# EAGLE design Analog PDB V1 (EAGLE 9.5.1)
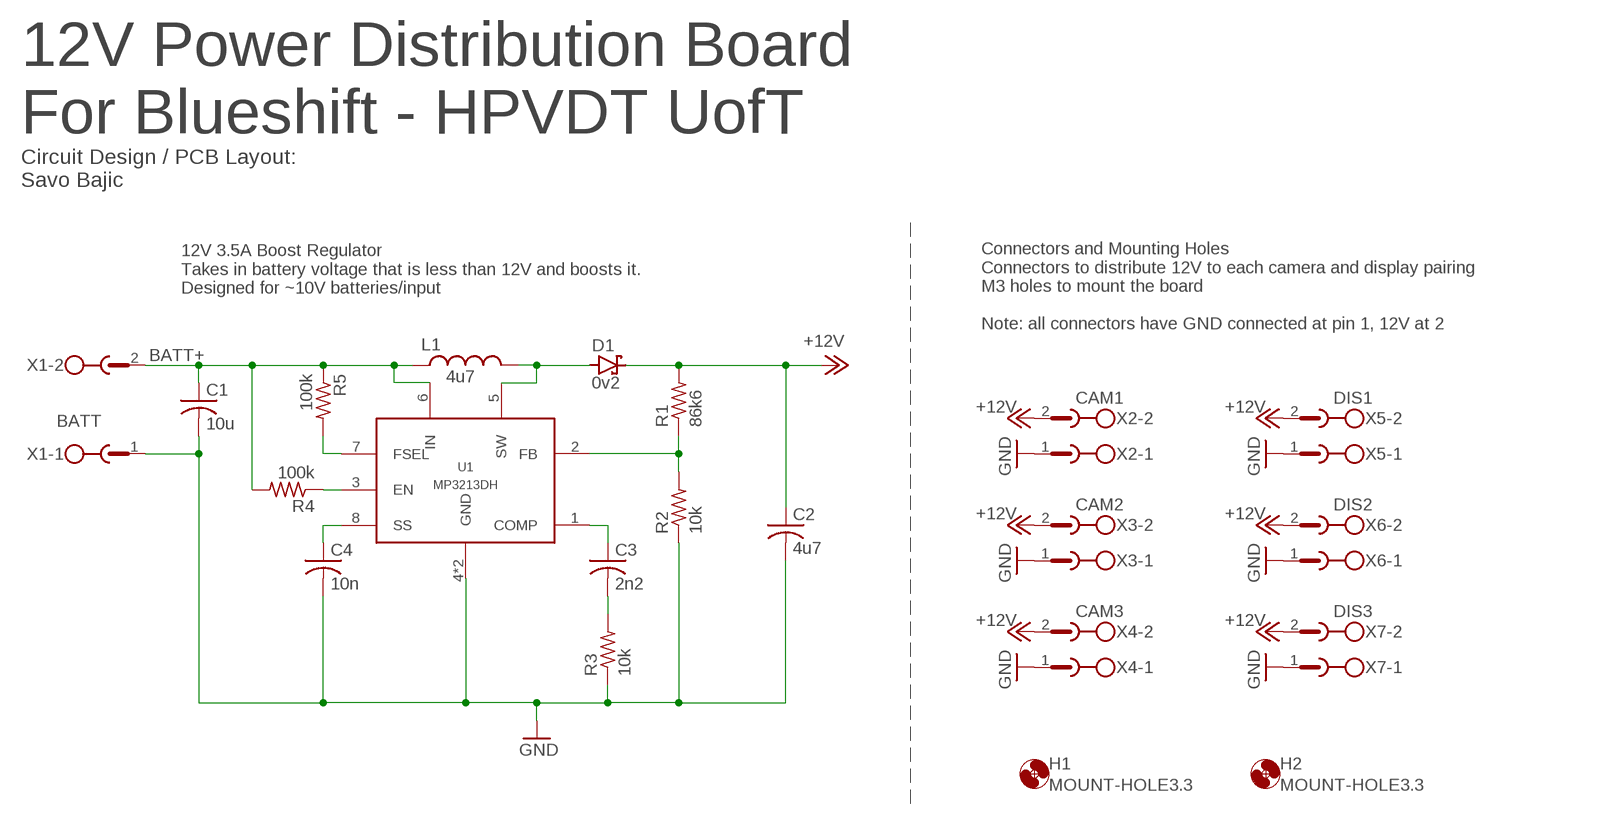
[diagram p0: schematic, sheet 1]

## Parts
C1  10u  C-USC0603  [C0603]
C2  4u7  C-USC0603  [C0603]
C3  2n2  C-USC0603  [C0603]
C4  10n  C-USC0603  [C0603]
D1  0v2  BOOSTDIODE  [DO-214AB]
H1  MOUNT-HOLE3.3  [3,3]
H2  MOUNT-HOLE3.3  [3,3]
L1  4u7  SDEI054T  [SDES053T]
R1  86k6  R-US_R0402  [R0402]
R2  10k  R-US_R0402  [R0402]
R3  10k  R-US_R0402  [R0402]
R4  100k  R-US_R0402  [R0402]
R5  100k  R-US_R0402  [R0402]
U1  MP3213DH  [8-TSSOP]
X1  BATT  MST2V  [MSTBV2]
X2  CAM1  MSTBV2  [MSTBV2]
X3  CAM2  MSTBV2  [MSTBV2]
X4  CAM3  MSTBV2  [MSTBV2]
X5  DIS1  MSTBV2  [MSTBV2]
X6  DIS2  MSTBV2  [MSTBV2]
X7  DIS3  MSTBV2  [MSTBV2]

## Nets
+12V: C2.1 D1.C R1.2 X2.2 X3.2 X4.2 X5.2 X6.2 X7.2
BATT+: C1.1 L1.1 R4.2 R5.1 U1.6(IN) X1.2
EN: R4.1 U1.3(EN)
FEEDBACK: R1.1 R2.2 U1.2(FB)
FREQSELECT: R5.2 U1.7(FSEL)
GND: C1.2 C2.2 C4.2 R2.1 R3.1 U1.4(GND) U1.P(GND) X1.1 X2.1 X3.1 X4.1 X5.1 X6.1 X7.1
N$1: D1.A L1.2 U1.5(SW)
N$5: C3.1 U1.1(COMP)
N$6: C3.2 R3.2
SOFTSTART: C4.1 U1.8(SS)

## Notes on the sheet
- 12V Power Distribution Board
  For Blueshift - HPVDT UofT
- Circuit Design / PCB Layout:
  Savo Bajic
- 12V 3.5A Boost Regulator
  Takes in battery voltage that is less than 12V and boosts it.
  Designed for ~10V batteries/input
- Connectors and Mounting Holes
  Connectors to distribute 12V to each camera and display pairing
  M3 holes to mount the board
  
  Note: all connectors have GND connected at pin 1, 12V at 2

## Library data of the parts
C1-C4 = rcl:C-US: CAPACITOR, American symbol; SPICEPREFIX: C
D1 = ASME2020_parts:BOOSTDIODE
H1 H2 = holes:MOUNT-HOLE: MOUNTING HOLE with drill center marker
L1 = ASME2020_parts:SDEI054T: 4.7uH Inductor
R1-R5 = rcl:R-US_: RESISTOR, American symbol; SPICEPREFIX: R
U1 = ASME2020_parts:MP3213DH: 3.5A Boost Converter Regulator
X1 = con-phoenix-508:MST2V: PHOENIX; OC_FARNELL: unknown; OC_NEWARK: unknown
X2-X7 = con-phoenix-508:MSTBV2: PHOENIX; MPN: MSTBV 2,5/2-GF-5.08; OC_FARNELL: 1792792; OC_NEWARK: 69R9845

## Board
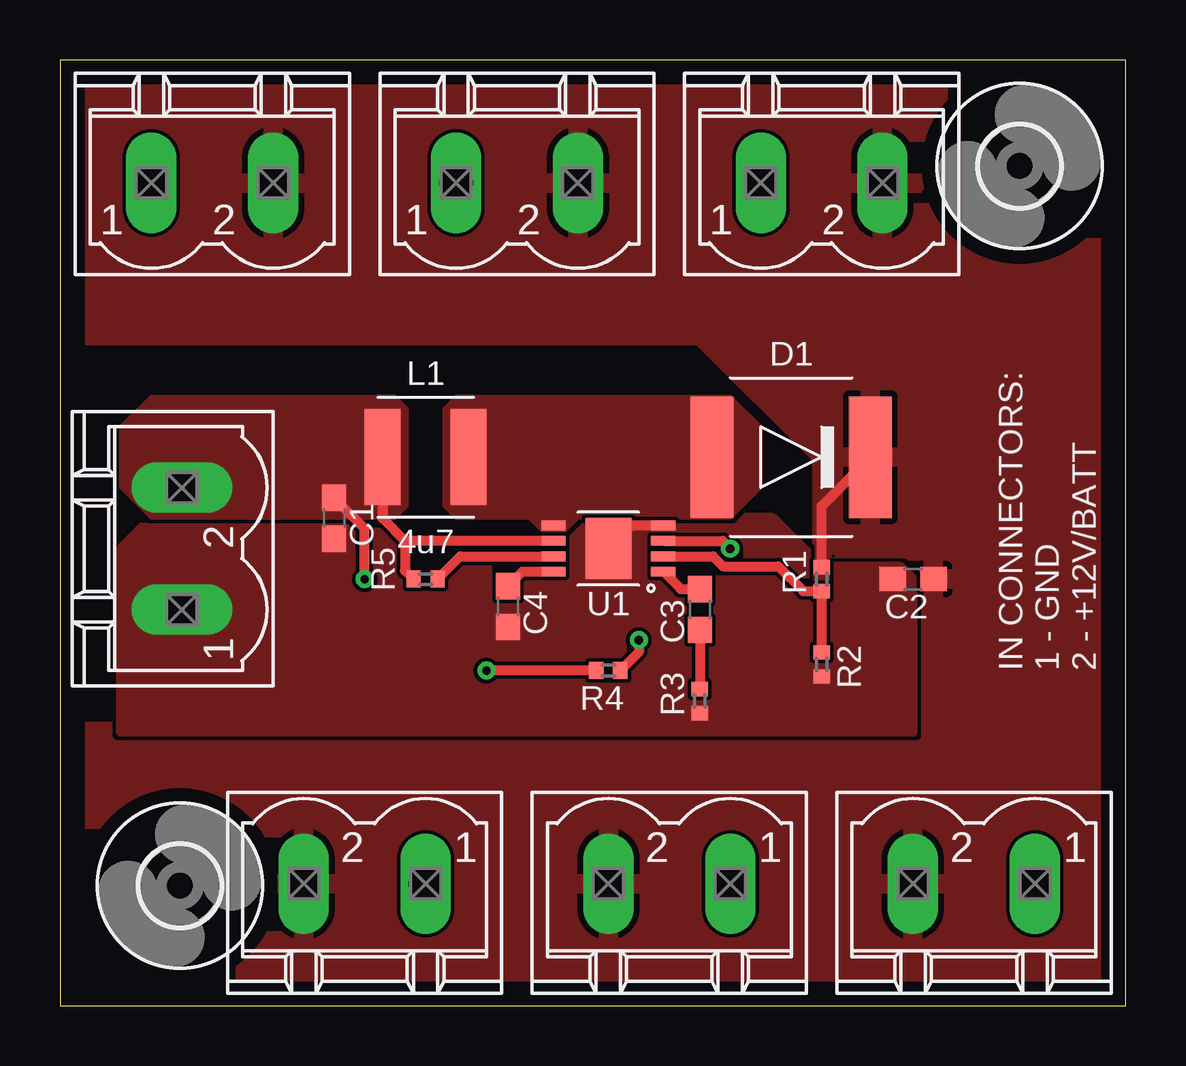
[diagram p1: board, top side]
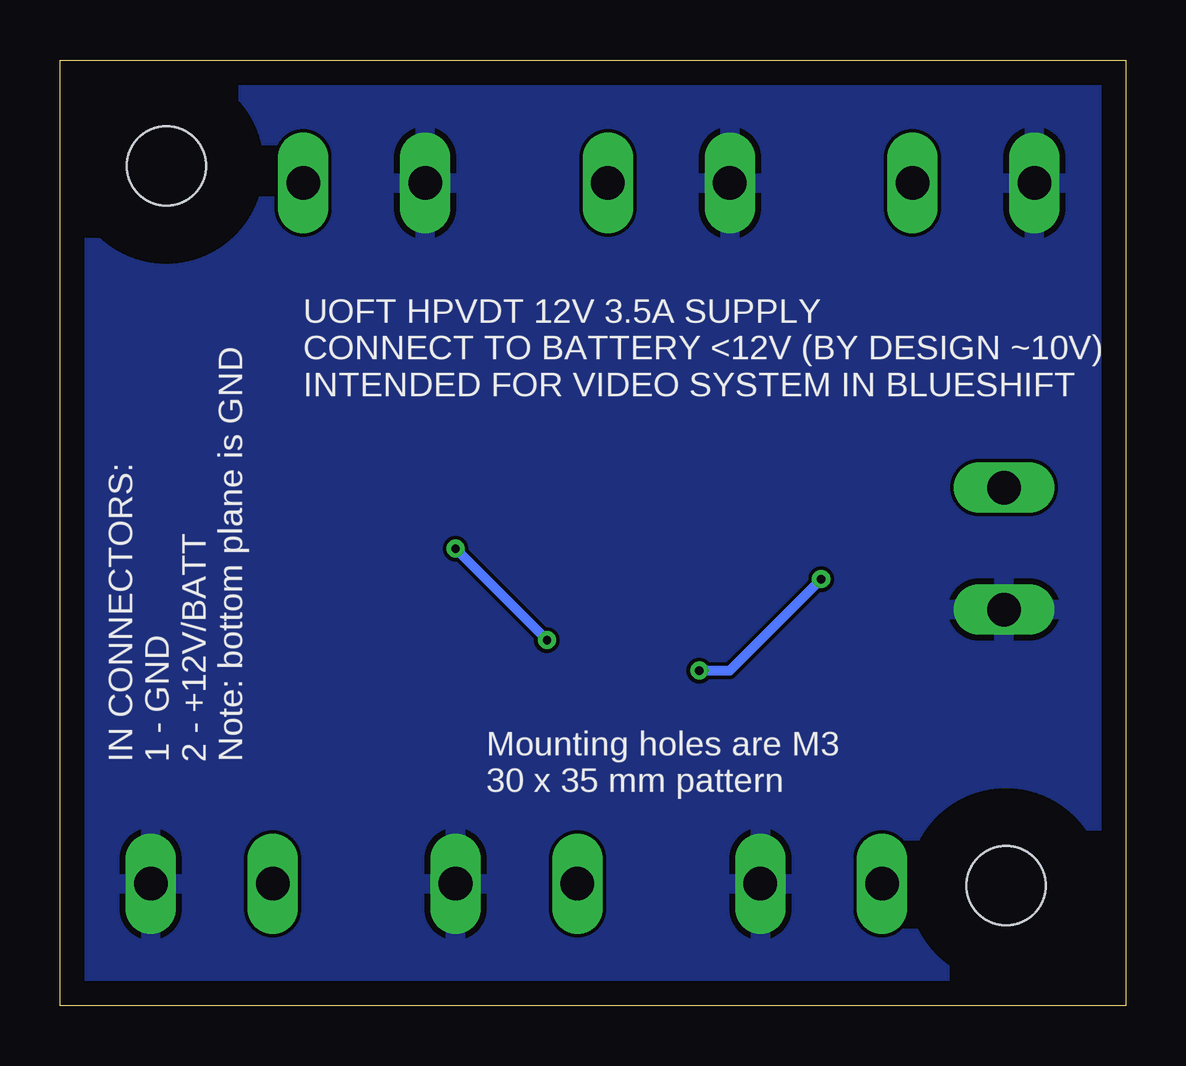
[diagram p2: board, bottom side, seen from below]

Size 44.43 x 39.42 mm. Coordinates in mm from the lower left corner, seen from the top.
Outline: 0,0 44.43,0 44.43,39.42 0,39.42 0,0
Copper layers (1*16): Top 0.035mm / dielectric 1.5mm / Bottom 0.035mm
Design rules "default": minimum track width 6mil, minimum drill 0.35mm, track to track 6mil, track to pad 6mil, pad to pad 6mil, via to via 6mil, smd to smd 6mil, copper to edge 40mil, drill to drill 6mil, minimum pad ring 10mil, minimum via ring 8mil, stop-mask expansion 4mil, vias tented up to drill 0mil, thermal gap 10mil

### Footprints (pad centres in the part's own frame; a part is rotated, then mirrored left to right if it is on the bottom)
C0603 = smd 1.1 x 1: 1 -0.85,0; 2 0.85,0
DO-214AB = smd 1.778 x 5.08: A -3.302,0; C 3.302,0
3,3 = hole 3.3: 0,0
SDES053T = smd 1.5 x 4: 1 -1.8,0; 2 1.8,0
R0402 = smd 0.6 x 0.7: 1 -0.5,0; 2 0.5,0
8-TSSOP = smd 1.016 x 0.406: 1 -2.286,0.96; 2 -2.286,0.325; 3 -2.286,-0.325; 4 -2.286,-0.96; 5 2.286,-0.96; 6 2.286,-0.325; 7 2.286,0.325; 8 2.286,0.96 | smd 1.905 x 2.54: P 0,0
MSTBV2 = drill 1.397 long: 1 -2.54,0; 2 2.54,0

### Placement (x,y rotation side)
C1  11.43,20.32 270 top
C2  35.56,17.78 180 top
C3  26.67,16.51 270 top
C4  18.67,16.64 270 top
D1  30.48,22.86 0 top
H1  5,5 0 top
H2  40,35 0 top
L1  15.24,22.86 0 top
R1  31.75,17.78 90 top
R2  31.75,14.22 90 top
R3  26.67,12.7 90 top
R4  22.86,13.97 180 top
R5  15.24,17.78 0 top
U1  22.86,19.05 180 top
X1  5.08,19.05 90 top
X2  25.4,5.08 180 top
X3  31.75,34.29 0 top
X4  6.35,34.29 0 top
X5  12.7,5.08 180 top
X6  38.1,5.08 180 top
X7  19.05,34.29 0 top

### Tracks (layer width: path | path; a pad name or v marks a point on that pad's centre or on a via)
+12V
  Top 0.406: R1.2 31.75,20.83 D1.C
  pour Top (rank 3): 0,0 0,11.43 35.56,11.43 35.56,17.78 31.75,17.78 31.75,22.86 26.67,27.94 0,27.94 0,39.37 44.45,39.37 44.45,0
BATT+  (via drill 0.35)
  Top 0.406: L1.1 13.44,20.32 14.38,19.38 | U1.6 14.38,19.38 | 14.38,19.38 14.38,18.14 R5.1 | R4.2 v17.78,13.97 | v12.7,17.78 12.7,19.9 C1.1
  Bottom 0.406: v17.78,13.97 16.51,13.97 v12.7,17.78
  pour Top (no thermals): 13.97,20.32 3.81,20.32 2.54,21.59 2.54,24.13 3.81,25.4 13.97,25.4 14.48,24.89 14.48,20.83
EN  (via drill 0.35)
  Top 0.406: v24.13,15.24 24.13,14.74 R4.1 | U1.3 27.61,19.38 v27.94,19.05
  Bottom 0.406: v24.13,15.24 v27.94,19.05
FEEDBACK
  Top 0.406: U1.2 27.23,18.73 27.64,18.32 29.94,18.32 30.98,17.28 R1.1 R2.2
FREQSELECT
  Top 0.406: R5.2 16.68,18.73 U1.7
GND
  Top 0.406: U1.4 23.82,20.01 U1.P
  pour Bottom: 0,0 44.45,0 44.45,39.37 0,39.37
  pour Top (rank 2, no thermals): 2.54,19.05 2.54,11.43 35.56,11.43 35.56,17.78 35.05,18.29 31.75,18.29 29.72,20.32 3.81,20.32
N$1
  pour Top (no thermals): 16,24.89 16.51,25.4 27.94,25.4 29.21,24.13 29.21,21.59 27.94,20.32 21.59,20.32 21.08,19.81 20.07,19.81 19.56,20.32 16.51,20.32 16,20.83
N$5
  Top 0.406: U1.1 25.88,17.36 C3.1
N$6
  Top 0.406: C3.2 R3.2
SOFTSTART
  Top 0.406: C4.1 19.27,18.09 U1.8

### Text on the board
tPlace: IN CONNECTORS: / 1 - GND / 2 - +12V/BATT
bPlace: UOFT HPVDT 12V 3.5A SUPPLY / CONNECT TO BATTERY <12V (BY DESIGN ~10V) / INTENDED FOR VIDEO SYSTEM IN BLUESHIFT | IN CONNECTORS: / 1 - GND / 2 - +12V/BATT / Note: bottom plane is GND | Mounting holes are M3 / 30 x 35 mm pattern